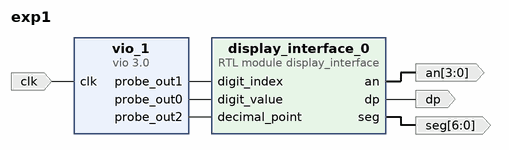
[diagram p0: block diagram of the top level]
# Vivado block design exp1, xc7a35tcpg236-1, Vivado 2020.1
create_bd_design exp1

create_bd_port -dir I -type clk clk
create_bd_port -dir O -from 6 -to 0 seg
create_bd_port -dir O dp
create_bd_port -dir O -from 3 -to 0 an

create_bd_cell -type ip -vlnv xilinx.com:ip:vio:3.0 vio_1
set_property -dict [list \
  CONFIG.C_NUM_PROBE_IN 0 \
  CONFIG.C_NUM_PROBE_OUT 3 \
  CONFIG.C_PROBE_OUT0_WIDTH 4 \
  CONFIG.C_PROBE_OUT1_WIDTH 3 \
] [get_bd_cells vio_1]
create_bd_cell -type module -reference display_interface display_interface_0

# ---- connections ----

connect_bd_net [get_bd_ports clk] [get_bd_pins vio_1/clk]
connect_bd_net [get_bd_pins vio_1/probe_out1] [get_bd_pins display_interface_0/digit_index]
connect_bd_net [get_bd_pins vio_1/probe_out0] [get_bd_pins display_interface_0/digit_value]
connect_bd_net [get_bd_pins vio_1/probe_out2] [get_bd_pins display_interface_0/decimal_point]
connect_bd_net [get_bd_pins display_interface_0/dp] [get_bd_ports dp]
connect_bd_net [get_bd_pins display_interface_0/seg] [get_bd_ports seg]
connect_bd_net [get_bd_pins display_interface_0/an] [get_bd_ports an]

validate_bd_design
save_bd_design
